# Altium schematic sheet Schematic.SchDoc
size A3; SheetNumber: 2; SheetTotal: 2
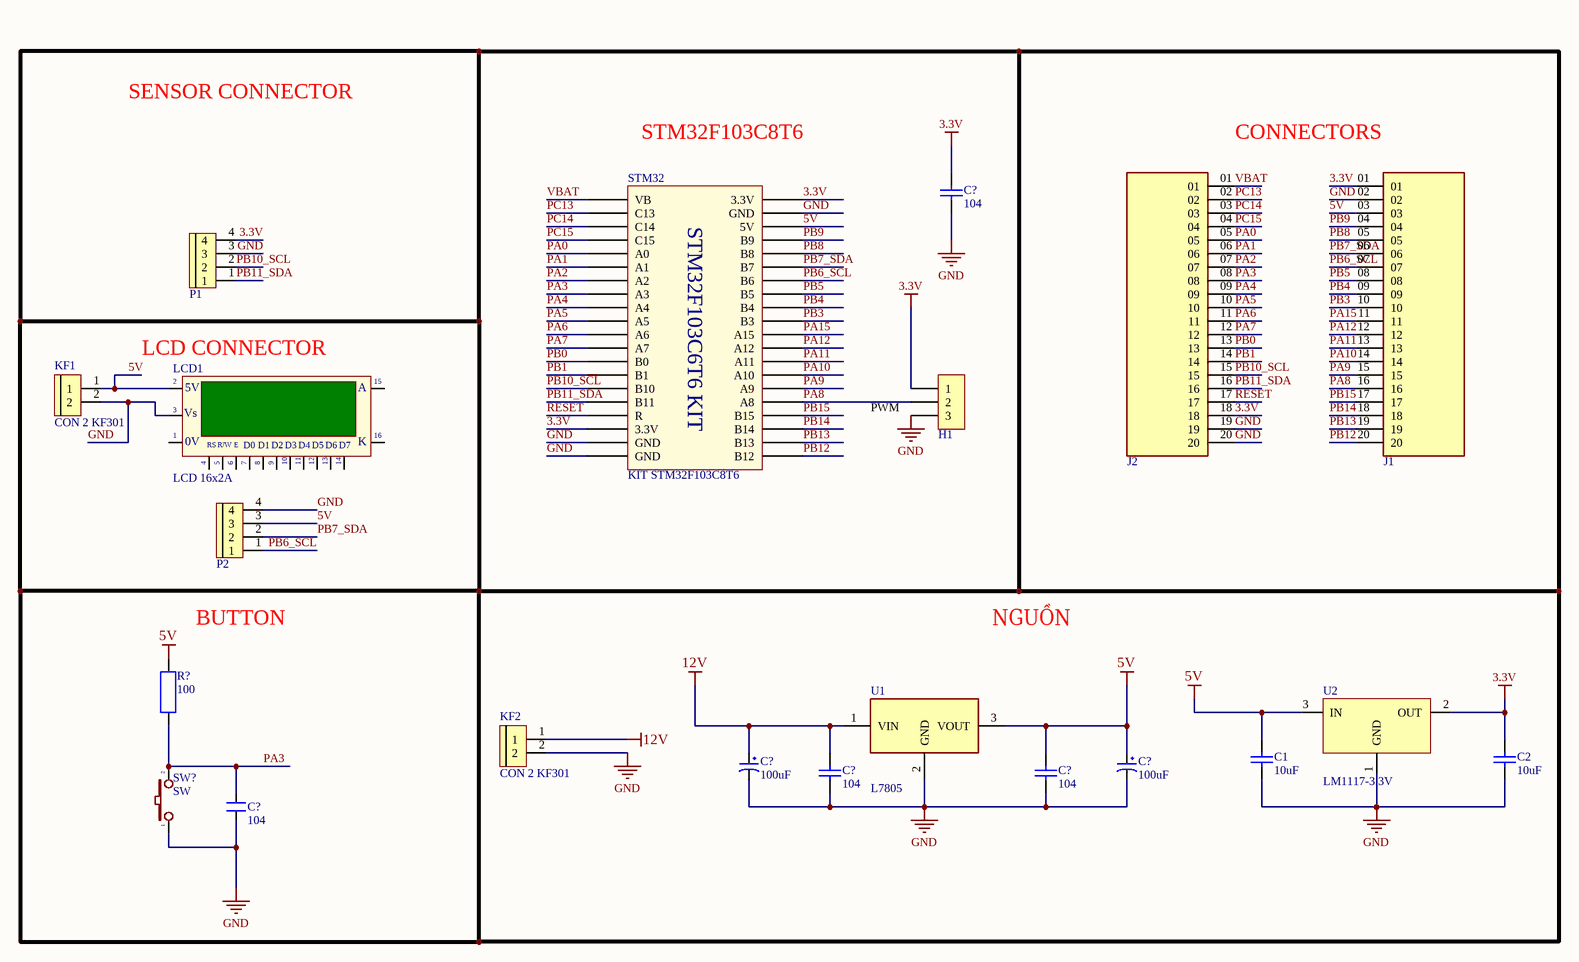
[diagram p0: Schematic.SchDoc]

## Parts
(Parts that share a designator on the sheet are numbered #1, #2 ... from top to bottom, then left to right.)
C1  10uF  [tu gom]
C2  10uF  [tu gom]
C?#1  104  [tu gom]
C?#2  100uF  [tu hoa 5mm]
C?#3  100uF  [tu hoa 5mm]
C?#4  104  [tu gom]
C?#5  104  [tu gom]
C?#6  104  [CN2]
H?  H1  [Header 3P DC 2.54]
J1  ESQ-120-13-G-S  [SAMTEC_ESQ-120-13-G-S]  (value not drawn)
J2  ESQ-120-13-G-S  [SAMTEC_ESQ-120-13-G-S]  (value not drawn)
KF1  CON 2 KF301  [Con 2 KF301 5.08]
KF2  CON 2 KF301  [Con 2 KF301 5.08]
LCD1  LCD 16x2A  [JP16-C1T]
P1  CON 4 EDG5.08  [CON 4 4EDG5.08]  (value not drawn)
P2  CON 4 EDG5.08  [CON 4 4EDG5.08]  (value not drawn)
R?  100  [R1W]
STM32  KIT STM32F103C8T6  [STM32F103 KIT]
SW?  SW  [SW2]
U1  L7805  [L7805_90]
U2  LM1117-3.3V  [SOT223]

## Nets
3.3V: C2.1 C?#1.1 H?.1 J1.01 J2.18 P1.4 STM32.20(3.3V) STM32.38(3.3V) U2.2(OUT)
5V: C1.1 C?#3.1 C?#5.1 J1.03 KF1.1 LCD1.2(VDD) P2.3 R?.2 STM32.18(5V) U1.3(VOUT) U2.3(IN)
12V: C?#2.1 C?#4.1 KF2.1 U1.1(VIN)
GND: C1.2 C2.2 C?#1.2 C?#2.2 C?#3.2 C?#4.2 C?#5.2 C?#6.1 H?.3 J1.02 J2.19 J2.20 KF1.2 KF2.2 LCD1.3(VEE) P1.3 P2.4 STM32.19(GND) STM32.39(GND) STM32.40(GND) SW?.1 U1.2(GND) U2.1(GND)
PA0: J2.05 STM32.25(A0)
PA1: J2.06 STM32.26(A1)
PA2: J2.07 STM32.27(A2)
PA3: C?#6.2 J2.08 R?.1 STM32.28(A3) SW?.2
PA4: J2.09 STM32.29(A4)
PA5: J2.10 STM32.30(A5)
PA6: J2.11 STM32.31(A6)
PA7: J2.12 STM32.32(A7)
PA8: H?.2 J1.16 STM32.5(A8)
PA9: J1.15 STM32.6(A9)
PA10: J1.14 STM32.7(A10)
PA11: J1.13 STM32.8(A11)
PA12: J1.12 STM32.9(A12)
PA15: J1.11 STM32.10(A15)
PB0: J2.13 STM32.33(B0)
PB1: J2.14 STM32.34(B1)
PB3: J1.10 STM32.11(B3)
PB4: J1.09 STM32.12(B4)
PB5: J1.08 STM32.13(B5)
PB6_SCL: J1.07 P2.1 STM32.14(B6)
PB7_SDA: J1.06 P2.2 STM32.15(B7)
PB8: J1.05 STM32.16(B8)
PB9: J1.04 STM32.17(B9)
PB10_SCL: J2.15 P1.2 STM32.35(B10)
PB11_SDA: J2.16 P1.1 STM32.36(B11)
PB12: J1.20 STM32.1(B12)
PB13: J1.19 STM32.2(B13)
PB14: J1.18 STM32.3(B14)
PB15: J1.17 STM32.4(B15)
PC13: J2.02 STM32.22(C13)
PC14: J2.03 STM32.23(C14)
PC15: J2.04 STM32.24(C15)
RESET: J2.17 STM32.37(R)
VBAT: J2.01 STM32.21(VB)

Not connected (* = marked no-connect by the designer): LCD1 1(GND) 4(RS) 5(R/~{W}) 6(~{EN}) 7(D0) 8(D1) 9(D2) 10(D3) 11(D4) 12(D5) 13(D6) 14(D7) 15(A) 16(K)

## Notes on the sheet
- SENSOR CONNECTOR
- STM32F103C8T6
- CONNECTORS
- (near LCD1) LCD CONNECTOR
- (near H?) PWM
- BUTTON
- NGUỒN
- (in symbol LCD16x2A) 5V; Vs; |; 0V; R/W; E
- (in symbol STM32f103 Bluepill) STM32F103C6T6 KIT

## Library data of the parts
C1 C2 = Tu gom 100 50V: Cắm; Don_Vi: Con; So_Chan: 2; Ten_Linh_Kien: Tụ gốm 100 10pF 50V; Ma_Hang: MH004765; Chung_Loai: Cắm; Kieu_Chan: *
C?#1 C?#4 C?#5 = Tu gom 104 50V: Cắm; So_Chan: 2; Ten_Linh_Kien: Tụ gốm 104 100nF 50V; Don_Vi: Con; Ma_Hang: MH004761; Chung_Loai: Cắm; Kieu_Chan: *
C?#2 C?#3 = Tu Hoa 100uF 25V 6x11: Cắm; Don_Vi: Con; So_Chan: 2; Ten_Linh_Kien: Tụ Hóa 100uF 25V 6x11MM; Ma_Hang: MH001351; Chung_Loai: Cắm; Kieu_Chan: *
C?#6 = CN2: Cap np 104 => 105pF; Value: 0.1uF
H? = Header 3P 2.54 Duc Cong: Cắm; Ten_Linh_Kien: Header 3P XH2.54-3P Đực Cong; Don_Vi: Con; Ma_Hang: MH001302; Chung_Loai: Cắm
KF1 KF2 = CON 2 KF301: Cắm; Ma_Hang: MH000987; Ten_Linh_Kien: CON 2 KF301-2P 5.08MM Xanh Dương; Chung_Loai: Cắm; Ghi_Chu: *; Kieu_Chan: *; Don_Vi: Con
LCD1 = LCD16x2A: LCD dipslay 16 char, 2 line; Value: LCD16x2A
P1 P2 = CON 4 EDG5.08: Cắm; Ten_Linh_Kien: CON 4 2EDG5.08-4P 5.08MM ( Xanh Cong); Ma_Hang: MH000979; Don_Vi: Con; Ghi_Chu: *; Kieu_Chan: *; Chung_Loai: Cắm
R? = R1W: Resistor 1W; Value: R1W - 100
STM32 = STM32f103 Bluepill: KIT STM32F103C8T6 Bluepill
SW? = SW2: Switch button 2 pin; Value: SW chip 2 pin
U1 = L7805: IC REG LINEAR 5V 1.5A TO220AB; ComponentLink1Description: Datasheet; ComponentLink1URL: https://www.mouser.com/datasheet/2/389/l78-1849632.pdf; Mouser PN: 511-L7805CV; Digikey PN: 497-1443-5-ND; JLCPCB PN PTH: C347289; JLCPCB PN SMD: C15077
U2 = LM1117: 800mA Low-Dropout Linear Regulator; Creator: Nguyen Ba Bien; Website: http://group3i.net
J1 J2 = ESQ-120-13-G-S: Price: None; MP: ESQ-120-13-G-S; Availability: Unavailable; Package: None; Value: *